# Altium schematic sheet VCU_SCH.SchDoc
size A3; SheetNumber: 1; SheetTotal: 1
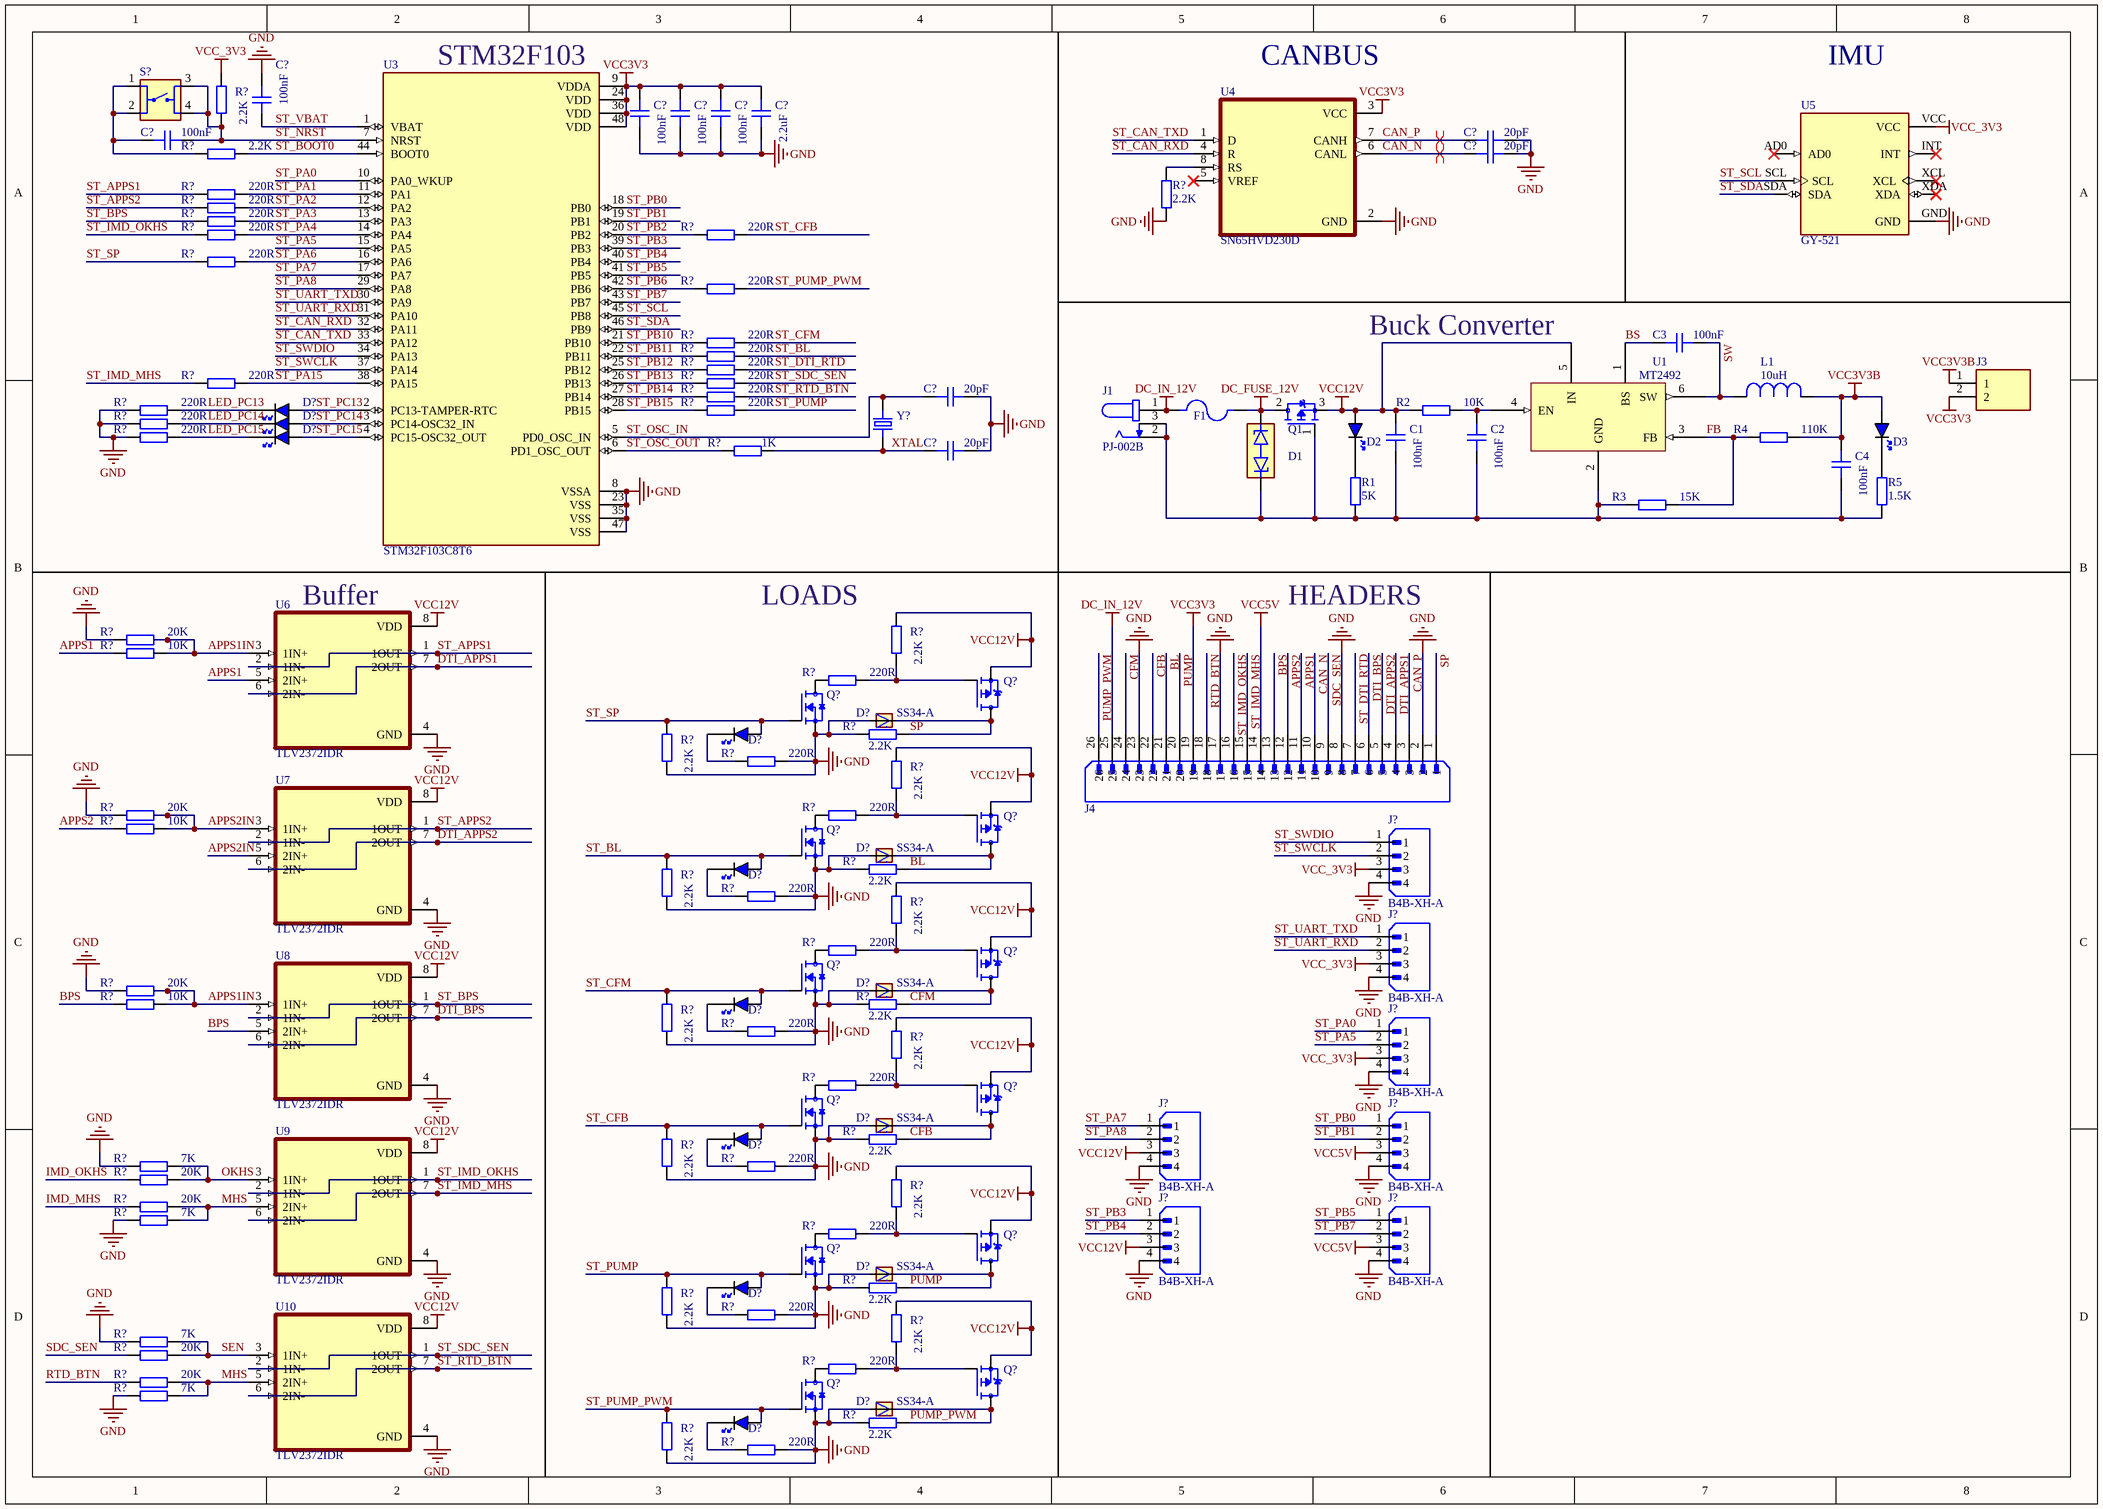
[diagram p0: VCU_SCH.SchDoc]

## Parts
(Parts that share a designator on the sheet are numbered #1, #2 ... from top to bottom, then left to right.)
C1  100nF  [CAP_0805]
C2  100nF  [CAP_0805]
C3  100nF  [CAP_0805]
C4  100nF  [CAP_0805]
C?#1  100nF  [CAP_0805]
C?#2  100nF  [CAP_0805]
C?#3  100nF  [CAP_0805]
C?#4  100nF  [CAP_0805]
C?#5  2.2uF  [CAP_0805]
C?#6  100nF  [CAP_0805]
C?#7  20pF  [CAP_0805]
C?#8  20pF  [CAP_0805]
C?#9  20pF  [CAP_0805]
C?#10  20pF  [CAP_0805]
D1  PESD1LIN  [DIO_PESD1LIN]  (value not drawn)
D2  BLUE  [LED_0805_BLUE]  (value not drawn)
D3  BLUE  [LED_0805_BLUE]  (value not drawn)
D?#1  BLUE  [LED_0805_BLUE]  (value not drawn)
D?#2  BLUE  [LED_0805_BLUE]  (value not drawn)
D?#3  BLUE  [LED_0805_BLUE]  (value not drawn)
D?#4  SS34-A  [DO-214AC]
D?#5  BLUE  [LED_0805_BLUE]  (value not drawn)
D?#6  SS34-A  [DO-214AC]
D?#7  BLUE  [LED_0805_BLUE]  (value not drawn)
D?#8  SS34-A  [DO-214AC]
D?#9  BLUE  [LED_0805_BLUE]  (value not drawn)
D?#10  SS34-A  [DO-214AC]
D?#11  BLUE  [LED_0805_BLUE]  (value not drawn)
D?#12  SS34-A  [DO-214AC]
D?#13  BLUE  [LED_0805_BLUE]  (value not drawn)
D?#14  SS34-A  [DO-214AC]
D?#15  BLUE  [LED_0805_BLUE]  (value not drawn)
F1  0697H0315-01  [FUSRR508W60L835T400H810]  (value not drawn)
J1  PJ-002B  [CUI_PJ-002B]
J3  3-644456-2  [TE_3-644456-2]  (value not drawn)
J4  9-6437287-8  [TE_9-6437287-8]  (value not drawn)
J?#1  B4B-XH-A  [JST_B4B-XH-A]
J?#2  B4B-XH-A  [JST_B4B-XH-A]
J?#3  B4B-XH-A  [JST_B4B-XH-A]
J?#4  B4B-XH-A  [JST_B4B-XH-A]
J?#5  B4B-XH-A  [JST_B4B-XH-A]
J?#6  B4B-XH-A  [JST_B4B-XH-A]
J?#7  B4B-XH-A  [JST_B4B-XH-A]
L1  10uH  [IND_CDRH127/LDNP-470MC_SUM]
Q1  IRF4905STRRPBF  [TRANS_IRF4905STRRPBF]  (value not drawn)
Q?#1  AO3407A  [SOT95P280X125-3N]  (value not drawn)
Q?#2  AO3400A  [SOT95P280X125-3N]  (value not drawn)
Q?#3  AO3407A  [SOT95P280X125-3N]  (value not drawn)
Q?#4  AO3400A  [SOT95P280X125-3N]  (value not drawn)
Q?#5  AO3407A  [SOT95P280X125-3N]  (value not drawn)
Q?#6  AO3400A  [SOT95P280X125-3N]  (value not drawn)
Q?#7  AO3407A  [SOT95P280X125-3N]  (value not drawn)
Q?#8  AO3400A  [SOT95P280X125-3N]  (value not drawn)
Q?#9  AO3407A  [SOT95P280X125-3N]  (value not drawn)
Q?#10  AO3400A  [SOT95P280X125-3N]  (value not drawn)
Q?#11  AO3407A  [SOT95P280X125-3N]  (value not drawn)
Q?#12  AO3400A  [SOT95P280X125-3N]  (value not drawn)
R1  5K  [RES_0805]
R2  10K  [RES_0805]
R3  15K  [RES_0805]
R4  110K  [RES_0805]
R5  1.5K  [RES_0805]
R?#1  2.2K  [RES_0805]
R?#2  2.2K  [RES_0805]
R?#3  220R  [RES_0805]
R?#4  2.2K  [RES_0805]
R?#5  220R  [RES_0805]
R?#6  220R  [RES_0805]
R?#7  220R  [RES_0805]
R?#8  220R  [RES_0805]
R?#9  220R  [RES_0805]
R?#10  220R  [RES_0805]
R?#11  220R  [RES_0805]
R?#12  220R  [RES_0805]
R?#13  220R  [RES_0805]
R?#14  220R  [RES_0805]
R?#15  220R  [RES_0805]
R?#16  220R  [RES_0805]
R?#17  220R  [RES_0805]
R?#18  220R  [RES_0805]
R?#19  220R  [RES_0805]
R?#20  220R  [RES_0805]
R?#21  1K  [RES_0805]
R?#22  20K  [RES_0805]
R?#23  2.2K  [RES_0805]
R?#24  10K  [RES_0805]
R?#25  220R  [RES_0805]
R?#26  2.2K  [RES_0805]
R?#27  2.2K  [RES_0805]
R?#28  220R  [RES_0805]
R?#29  2.2K  [RES_0805]
R?#30  20K  [RES_0805]
R?#31  220R  [RES_0805]
R?#32  10K  [RES_0805]
R?#33  2.2K  [RES_0805]
R?#34  2.2K  [RES_0805]
R?#35  220R  [RES_0805]
R?#36  2.2K  [RES_0805]
R?#37  220R  [RES_0805]
R?#38  20K  [RES_0805]
R?#39  10K  [RES_0805]
R?#40  2.2K  [RES_0805]
R?#41  2.2K  [RES_0805]
R?#42  220R  [RES_0805]
R?#43  2.2K  [RES_0805]
R?#44  220R  [RES_0805]
R?#45  2.2K  [RES_0805]
R?#46  2.2K  [RES_0805]
R?#47  7K  [RES_0805]
R?#48  220R  [RES_0805]
R?#49  20K  [RES_0805]
R?#50  2.2K  [RES_0805]
R?#51  20K  [RES_0805]
R?#52  7K  [RES_0805]
R?#53  220R  [RES_0805]
R?#54  2.2K  [RES_0805]
R?#55  2.2K  [RES_0805]
R?#56  220R  [RES_0805]
R?#57  2.2K  [RES_0805]
R?#58  7K  [RES_0805]
R?#59  20K  [RES_0805]
R?#60  220R  [RES_0805]
R?#61  20K  [RES_0805]
R?#62  7K  [RES_0805]
R?#63  2.2K  [RES_0805]
R?#64  2.2K  [RES_0805]
R?#65  220R  [RES_0805]
S?  FSM8JH  [SW_FSM8JH]  (value not drawn)
U1  MT2492  [PCBComponent_1 - duplicate]
U3  STM32F103C8T6  [QFP50P900X900X160-48N]
U4  SN65HVD230D  [SOIC127P599X175-8N]
U5  GY-521  [MODULE_GY-521]
U6  TLV2372IDR  [SOIC127P599X175-8N]
U7  TLV2372IDR  [SOIC127P599X175-8N]
U8  TLV2372IDR  [SOIC127P599X175-8N]
U9  TLV2372IDR  [SOIC127P599X175-8N]
U10  TLV2372IDR  [SOIC127P599X175-8N]
Y?  ECS-80-20-5PVX  [XTAL_ECS-80-20-5PVX]  (value not drawn)

## Nets
DC_FUSE_12V: D1.2 F1.2 Q1.2(D)
DC_IN_12V: F1.1 J1.1 J4.25
GND: C?#1.1 C?#2.2 C?#3.2 C?#4.2 C?#5.2 C?#7.2 C?#8.2 C?#9.2 C?#10.2 D?#4.A D?#6.A D?#8.A D?#10.A D?#12.A D?#14.A J4.2 J4.8 J4.17 J4.23 J?#1.4 J?#2.4 J?#3.4 J?#4.4 J?#5.4 J?#6.4 J?#7.4 Q?#2.2(S) Q?#4.2(S) Q?#6.2(S) Q?#8.2(S) Q?#10.2(S) Q?#12.2(S) R?#4.1 R?#17.1 R?#19.1 R?#20.1 R?#22.1 R?#26.2 R?#27.1 R?#28.2 R?#30.1 R?#33.2 R?#34.1 R?#35.2 R?#38.1 R?#40.2 R?#41.1 R?#42.2 R?#45.2 R?#46.1 R?#47.1 R?#48.2 R?#52.1 R?#54.2 R?#55.1 R?#56.2 R?#58.1 R?#62.1 R?#63.2 R?#64.1 R?#65.2 U3.8(VSSA) U3.23(VSS) U3.35(VSS) U3.47(VSS) U4.2(GND) U5.GND U6.4(GND) U7.4(GND) U8.4(GND) U9.4(GND) U10.4(GND)
VCC3V3: C?#2.1 C?#3.1 C?#4.1 C?#5.1 J3.2 J4.19 U3.9(VDDA) U3.24(VDD) U3.36(VDD) U3.48(VDD) U4.3(VCC)
VCC3V3B: C4.1 D3.A J3.1 L1.1 R4.2
VCC5V: J4.14 J?#5.3 J?#7.3
VCC12V: C1.1 D2.A J?#4.3 J?#6.3 Q1.3(S) Q?#1.2(S) Q?#3.2(S) Q?#5.2(S) Q?#7.2(S) Q?#9.2(S) Q?#11.2(S) R2.1 R?#23.2 R?#29.2 R?#36.2 R?#43.2 R?#50.2 R?#57.2 U1.5(IN) U6.8(VDD) U7.8(VDD) U8.8(VDD) U9.8(VDD) U10.8(VDD)
VCC_3V3: J?#1.3 J?#2.3 J?#3.3 R?#1.2 U5.VCC
APPS1: J4.11 R?#24.1 U6.5(2IN+)
APPS1IN: R?#22.2 R?#24.2 R?#38.2 R?#39.2 U6.3(1IN+) U8.3(1IN+)
APPS2: J4.12 R?#32.1
APPS2IN: R?#30.2 R?#32.2 U7.3(1IN+) U7.5(2IN+)
BL: D?#6.C J4.21 Q?#3.3(D) R?#33.1
BPS: J4.13 R?#39.1 U8.5(2IN+)
BS: C3.1 U1.1(BS)
CAN_N: C?#8.1 J4.10 U4.6(CANL)
CAN_P: C?#7.1 J4.3 U4.7(CANH)
CFB: D?#10.C J4.22 Q?#7.3(D) R?#45.1
CFM: D?#8.C J4.24 Q?#5.3(D) R?#40.1
DTI_APPS1: J4.4 U6.6(2IN-) U6.7(2OUT)
DTI_APPS2: J4.5 U7.6(2IN-) U7.7(2OUT)
DTI_BPS: J4.6 U8.6(2IN-) U8.7(2OUT)
FB: R3.2 R4.1 U1.3(FB)
IMD_MHS: R?#51.1
IMD_OKHS: R?#49.1
LED_PC13: D?#1.K R?#17.2
LED_PC14: D?#2.K R?#19.2
LED_PC15: D?#3.K R?#20.2
MHS: R?#51.2 R?#52.2 R?#61.2 R?#62.2 U9.5(2IN+) U10.5(2IN+)
OKHS: R?#47.2 R?#49.2 U9.3(1IN+)
PUMP: D?#12.C J4.20 Q?#9.3(D) R?#54.1
PUMP_PWM: D?#14.C J4.26 Q?#11.3(D) R?#63.1
RTD_BTN: J4.18 R?#61.1
SDC_SEN: J4.9 R?#59.1
SEN: R?#58.2 R?#59.2 U10.3(1IN+)
SP: D?#4.C J4.1 Q?#1.3(D) R?#26.1
ST_APPS1: R?#3.1 U6.1(1OUT) U6.2(1IN-)
ST_APPS2: R?#5.1 U7.1(1OUT) U7.2(1IN-)
ST_BL: D?#7.A Q?#4.1(G) R?#12.2 R?#34.2
ST_BOOT0: R?#2.2 U3.44(BOOT0)
ST_BPS: R?#6.1 U8.1(1OUT) U8.2(1IN-)
ST_CAN_RXD: U3.32(PA11) U4.4(R)
ST_CAN_TXD: U3.33(PA12) U4.1(D)
ST_CFB: D?#11.A Q?#8.1(G) R?#8.2 R?#46.2
ST_CFM: D?#9.A Q?#6.1(G) R?#11.2 R?#41.2
ST_DTI_RTD: J4.7 R?#13.2
ST_IMD_MHS: J4.15 R?#14.1 U9.6(2IN-) U9.7(2OUT)
ST_IMD_OKHS: J4.16 R?#7.1 U9.1(1OUT) U9.2(1IN-)
ST_NRST: C?#6.2 R?#1.1 S?.3 S?.4 U3.7(NRST)
ST_OSC_IN: C?#9.1 U3.5(PD0_OSC_IN) Y?.2
ST_OSC_OUT: R?#21.1 U3.6(PD1_OSC_OUT)
ST_PA0: J?#3.1 U3.10(PA0_WKUP)
ST_PA1: R?#3.2 U3.11(PA1)
ST_PA2: R?#5.2 U3.12(PA2)
ST_PA3: R?#6.2 U3.13(PA3)
ST_PA4: R?#7.2 U3.14(PA4)
ST_PA5: J?#3.2 U3.15(PA5)
ST_PA6: R?#9.2 U3.16(PA6)
ST_PA7: J?#4.1 U3.17(PA7)
ST_PA8: J?#4.2 U3.29(PA8)
ST_PA15: R?#14.2 U3.38(PA15)
ST_PB0: J?#5.1 U3.18(PB0)
ST_PB1: J?#5.2 U3.19(PB1)
ST_PB2: R?#8.1 U3.20(PB2)
ST_PB3: J?#6.1 U3.39(PB3)
ST_PB4: J?#6.2 U3.40(PB4)
ST_PB5: J?#7.1 U3.41(PB5)
ST_PB6: R?#10.1 U3.42(PB6)
ST_PB7: J?#7.2 U3.43(PB7)
ST_PB10: R?#11.1 U3.21(PB10)
ST_PB11: R?#12.1 U3.22(PB11)
ST_PB12: R?#13.1 U3.25(PB12)
ST_PB13: R?#15.1 U3.26(PB13)
ST_PB14: R?#16.1 U3.27(PB14)
ST_PB15: R?#18.1 U3.28(PB15)
ST_PC13: D?#1.A U3.2(PC13-TAMPER-RTC)
ST_PC14: D?#2.A U3.3(PC14-OSC32_IN)
ST_PC15: D?#3.A U3.4(PC15-OSC32_OUT)
ST_PUMP: D?#13.A Q?#10.1(G) R?#18.2 R?#55.2
ST_PUMP_PWM: D?#15.A Q?#12.1(G) R?#10.2 R?#64.2
ST_RTD_BTN: R?#16.2 U10.6(2IN-) U10.7(2OUT)
ST_SCL: U3.45(PB8) U5.SCL
ST_SDA: U3.46(PB9) U5.SDA
ST_SDC_SEN: R?#15.2 U10.1(1OUT) U10.2(1IN-)
ST_SP: D?#5.A Q?#2.1(G) R?#9.1 R?#27.2
ST_SWCLK: J?#1.2 U3.37(PA14)
ST_SWDIO: J?#1.1 U3.34(PA13)
ST_UART_RXD: J?#2.2 U3.31(PA10)
ST_UART_TXD: J?#2.1 U3.30(PA9)
ST_VBAT: C?#1.2 U3.1(VBAT)
SW: C3.2 L1.2 U1.6(SW)
XTAL: C?#10.1 R?#21.2 Y?.1
NetC1_2: C1.2 C2.2 C4.2 D1.1 J1.2 J1.3 Q1.1(G) R1.1 R3.1 R5.1 U1.2(GND)
NetC2_1: C2.1 R2.2 U1.4(EN)
NetC?#6_1: C?#6.1 R?#2.1 S?.1 S?.2
NetD2_K: D2.K R1.2
NetD3_K: D3.K R5.2
NetD?#5_K: D?#5.K R?#28.1
NetD?#7_K: D?#7.K R?#35.1
NetD?#9_K: D?#9.K R?#42.1
NetD?#11_K: D?#11.K R?#48.1
NetD?#13_K: D?#13.K R?#56.1
NetD?#15_K: D?#15.K R?#65.1
NetQ?#1_1: Q?#1.1(G) R?#23.1 R?#25.2
NetQ?#2_3: Q?#2.3(D) R?#25.1
NetQ?#3_1: Q?#3.1(G) R?#29.1 R?#31.2
NetQ?#4_3: Q?#4.3(D) R?#31.1
NetQ?#5_1: Q?#5.1(G) R?#36.1 R?#37.2
NetQ?#6_3: Q?#6.3(D) R?#37.1
NetQ?#7_1: Q?#7.1(G) R?#43.1 R?#44.2
NetQ?#8_3: Q?#8.3(D) R?#44.1
NetQ?#9_1: Q?#9.1(G) R?#50.1 R?#53.2
NetQ?#10_3: Q?#10.3(D) R?#53.1
NetQ?#11_1: Q?#11.1(G) R?#57.1 R?#60.2
NetQ?#12_3: Q?#12.3(D) R?#60.1
NetR?#4_2: R?#4.2 U4.8(RS)

Not connected (* = marked no-connect by the designer): U4 5(VREF)*; U5 AD0* INT* XCL* XDA*

## Layout directives
differential pair: CAN_N, CAN_P

## Notes on the sheet
- (near U3) STM32F103
- (near U4) CANBUS
- IMU
- (near U1) Buck Converter
- (near U6) Buffer
- LOADS
- HEADERS

## Library data of the parts
C1-C4 C?#1-C?#10 = CAP_0805: Capacitor SMD 0805; Manufacturer: *; Manufacturer Part Number: *; Distributor Link: *; LCSC: *; Rating: *; Dielectric: *
D1 = PESD1LIN: 44V, 70V Clamp 3A (8/20Âµs) Ipp Tvs Diode Surface Mount SOD-323; MF: Nexperia USA; SnapEDA_Link: https://www.snapeda.com/parts/PESD1LIN/Nexperia/view-part/?ref=snap; Package: SOD-323 Vishay Semiconductor Diodes Division; Value: *; MP: PESD1LIN; Check_prices: https://www.snapeda.com/parts/PESD1LIN/Nexperia/view-part/?ref=eda
D2 D3 D?#1-D?#3 D?#5 D?#7 D?#9 D?#11 D?#13 D?#15 = LED_0805_BLUE: LED 0805 BLUE SMD; Manufacturer: *; Manufacturer Part Number: *; Distributor Link: *; LCSC: *
D?#4 D?#6 D?#8 D?#10 D?#12 D?#14 = SS34-A: Schottky barrier diode, 3A, 40V; MF: hy electronic corp; MP: SS34A; SnapEDA_Link: https://www.snapeda.com/parts/SS34A/HY+Electronic/view-part/?ref=snap; Package: None; Value: *; Check_prices: https://www.snapeda.com/parts/SS34A/HY+Electronic/view-part/?ref=eda
F1 = 0697H0315-01: 2-Pin Radial Fuse | Rectangular | Slow Blow | UL | 315mA; MF: Bel Fuse; SnapEDA_Link: https://www.snapeda.com/parts/0697H0315-01/Bel+Circuit+Protection/view-part/?ref=snap; Package: Radial Box  Bel Fuse; Value: *; MP: 0697H0315-01; Check_prices: https://www.snapeda.com/parts/0697H0315-01/Bel+Circuit+Protection/view-part/?ref=eda
J1 = PJ-002B: 2.5 x 6.5 mm, 2.5 A, Horizontal, Through Hole, Dc Power Jack Connector; MF: Same Sky; SnapEDA_Link: https://www.snapeda.com/parts/PJ-002B/Same+Sky/view-part/?ref=snap; Package: None; Value: *; MP: PJ-002B; Check_prices: https://www.snapeda.com/parts/PJ-002B/Same+Sky/view-part/?ref=eda
J3 = 3-644456-2: HEADER ASSEMBLY, NARROW, MTA-100, 2 POSITION, STRAIGHT | TE Connectivity 3-644456-2; SnapEDA_Link: https://www.snapeda.com/parts/3-644456-2/TE+Connectivity+AMP+Connectors/view-part/?ref=snap; Package: None; Value: *; MF: TE Connectivity; MP: 3-644456-2; Check_prices: https://www.snapeda.com/parts/3-644456-2/TE+Connectivity+AMP+Connectors/view-part/?ref=eda
J4 = 9-6437287-8: MF: {'manufacturer': 'TE Connectivity'}; Package: None; Value: *; Availability: Unavailable; MP: 9-6437287-8; Price: None
J?#1-J?#7 = B4B-XH-A: Connector Header Through Hole 4 position 0.098 (2.50mm); MF: JST Sales; SnapEDA_Link: https://www.snapeda.com/parts/B4B-XH-A/JST/view-part/?ref=snap; Package: None; Value: *; MP: B4B-XH-A; Check_prices: https://www.snapeda.com/parts/B4B-XH-A/JST/view-part/?ref=eda
L1 = CDRH127/LDNP-470MC: Inductor Power Shielded Drum Core 47uH 20% 1KHz Ferrite 4.1A 0.078Ohm DCR T/R; MF: Sumida Corporation; SnapEDA_Link: https://www.snapeda.com/parts/CDRH127/LDNP-470MC/Sumida/view-part/?ref=snap; Package: Non Standard Sumida; Value: *; MP: CDRH127/LDNP-470MC; Check_prices: https://www.snapeda.com/parts/CDRH127/LDNP-470MC/Sumida/view-part/?ref=eda
Q1 = IRF4905STRRPBF: RoHS Compliant | Low RDS(on) | Industry-leading quality | Dynamic dv/dt Rating | Fast Switching | Fully Avalanche Rated | 175C Operating Temperature | P-Channel MOSFET; MF: Infineon Technologies; Package: D2PAK Infineon; Price: None; Availability: In Stock; Purchase-URL: https://pricing.snapeda.com/search/part/IRF4905STRRPBF/?ref=eda; Check_prices: https://www.snapeda.com/parts/IRF4905STRRPBF/Infineon+Technologies/view-part/?ref=eda; MP: IRF4905STRRPBF; SnapEDA_Link: https://www.snapeda.com/parts/IRF4905STRRPBF/Infineon+Technologies/view-part/?ref=snap; Value: *
Q?#1 Q?#3 Q?#5 Q?#7 Q?#9 Q?#11 = AO3407A: P-Channel 30 V 4.3A (Ta) 1.4W (Ta) Surface Mount SOT-23-3; MF: Alpha &; SnapEDA_Link: https://www.snapeda.com/parts/AO3407A/Alpha/view-part/?ref=snap; Package: SOT-23 Alpha &amp; Omega Semiconductor; Value: *; MP: AO3407A; Check_prices: https://www.snapeda.com/parts/AO3407A/Alpha/view-part/?ref=eda
Q?#2 Q?#4 Q?#6 Q?#8 Q?#10 Q?#12 = AO3400A: N-Channel 30 V 5.8A (Ta) 1.4W (Ta) Surface Mount SOT-23; MF: UMW; SnapEDA_Link: https://www.snapeda.com/parts/AO3400A/UMW/view-part/?ref=snap; Package: None; Value: *; MP: AO3400A; Check_prices: https://www.snapeda.com/parts/AO3400A/UMW/view-part/?ref=eda
R1-R5 R?#1-R?#65 = RES_0805: Resistor SMD 0805; Manufacturer: *; Manufacturer Part Number: *; Distributor Link: *; LCSC: *
S? = FSM8JH: Tactile Switch SPST-NO Top Actuated Through Hole; MF: TE Connectivity; Check_prices: https://www.snapeda.com/parts/FSM8JH/TE+Connectivity+ALCOSWITCH+Switches/view-part/?ref=eda; Value: *; Availability: In Stock; MP: FSM8JH; Price: None; Package: None; SnapEDA_Link: https://www.snapeda.com/parts/FSM8JH/TE+Connectivity+ALCOSWITCH+Switches/view-part/?ref=snap
U1 = MT2492: DC-DC step-down converter (buck converter)
U3 = STM32F103C8T6: ARM® Cortex®-M3 STM32F1 Microcontroller IC 32-Bit 72MHz 64KB (64K x 8) FLASH 48-LQFP (7x7); MF: STMicroelectronics; SnapEDA_Link: https://www.snapeda.com/parts/STM32F103C8T6/STMicroelectronics/view-part/?ref=snap; Package: LQFP-48 STMicroelectronics; Value: *; MP: STM32F103C8T6; Check_prices: https://www.snapeda.com/parts/STM32F103C8T6/STMicroelectronics/view-part/?ref=eda
U4 = SN65HVD230D: 3.3 V CAN Transceiver with Standby Mode; MF: Texas Instruments; SnapEDA_Link: https://www.snapeda.com/parts/SN65HVD230D/Texas+Instruments/view-part/?ref=snap; Package: SOIC-8 Texas Instruments; Value: *; MP: SN65HVD230D; Check_prices: https://www.snapeda.com/parts/SN65HVD230D/Texas+Instruments/view-part/?ref=eda
U5 = GY-521: Triple Axis Accelerometer Gyro Breakout; MF: GODREAM FORDREAM CO., LIMITED; SnapEDA_Link: https://www.snapeda.com/parts/GY-521/GODREAM+FORDREAM+CO.%252C+LIMITED/view-part/?ref=snap; Package: Package; Value: *; MP: GY-521; Check_prices: https://www.snapeda.com/parts/GY-521/GODREAM+FORDREAM+CO.%252C+LIMITED/view-part/?ref=eda
U6-U10 = TLV2372IDR: Dual, 16-V, 3-MHz, RRIO operational amplifier; MF: Texas Instruments; SnapEDA_Link: https://www.snapeda.com/parts/TLV2372IDR/Texas+Instruments/view-part/?ref=snap; Package: SOIC-8 Texas Instruments; Value: *; MP: TLV2372IDR; Check_prices: https://www.snapeda.com/parts/TLV2372IDR/Texas+Instruments/view-part/?ref=eda
Y? = ECS-80-20-5PVX: SMD Quartz crystal; Package: None; Price: None; Value: *; MP: ECS-80-20-5PVX; Availability: Unavailable